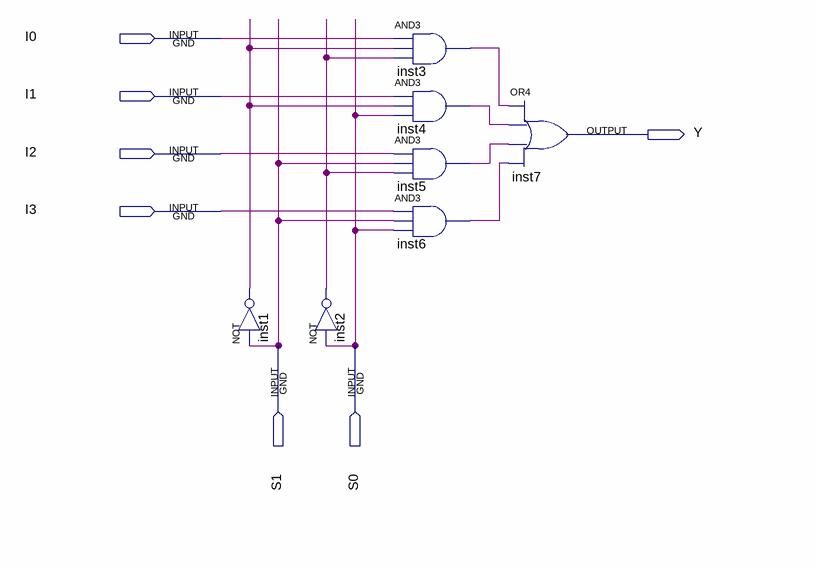
[diagram p0: schematic sheet]
// Quartus schematic MUX4to1.bdf as structural Verilog: 7 symbols, 7 pins
module MUX4to1 (
  input  I0,
  input  I1,
  input  I2,
  input  I3,
  input  S1,
  input  S0,
  output Y
);

  wire inst1_out, inst2_out, inst3_out, inst4_out, inst5_out, inst6_out;

  not inst1 (inst1_out, S1);
  not inst2 (inst2_out, S0);
  and inst3 (inst3_out, I0, inst1_out, inst2_out);
  and inst4 (inst4_out, I1, inst1_out, S0);
  and inst5 (inst5_out, I2, S1, inst2_out);
  and inst6 (inst6_out, I3, S1, S0);
  or inst7 (Y, inst3_out, inst4_out, inst5_out, inst6_out);
endmodule
